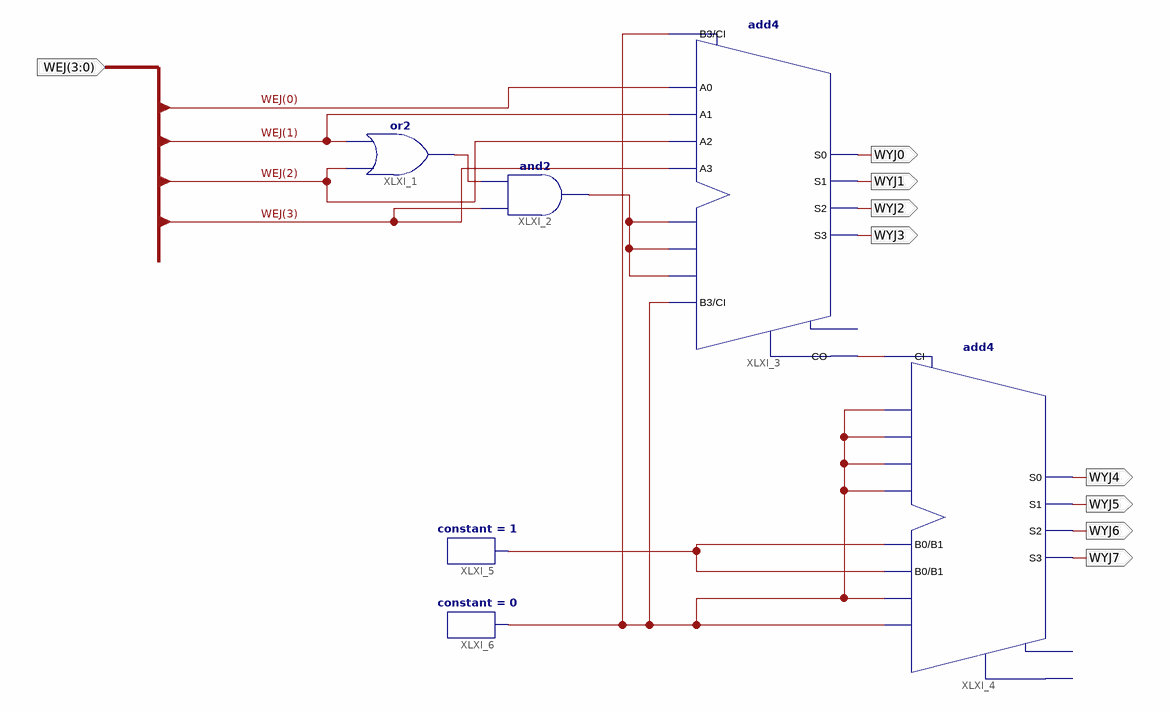
[diagram p0: schematic sheet 1]
// Xilinx ISE schematic scheme_diodes.sch (xc9500xl) as structural Verilog: 6 symbols, 9 ports
module scheme_diodes (
  input  [3:0] WEJ,
  output WYJ0,
  output WYJ1,
  output WYJ2,
  output WYJ3,
  output WYJ4,
  output WYJ5,
  output WYJ6,
  output WYJ7
);

  wire XLXN_8, XLXN_11, XLXN_22, XLXN_27, XLXN_30;

  or XLXI_1 (XLXN_22, WEJ[2], WEJ[1]);
  and XLXI_2 (XLXN_27, WEJ[3], XLXN_22);
  add4 XLXI_3 (
    .A0(WEJ[0]), .A1(WEJ[1]), .A2(WEJ[2]), .A3(WEJ[3]), .B0(XLXN_27), .B1(XLXN_27), .B2(XLXN_27),
    .B3(XLXN_30), .CI(XLXN_30), .CO(XLXN_11), .S0(WYJ0), .S1(WYJ1), .S2(WYJ2), .S3(WYJ3));  // open: OFL
  add4 XLXI_4 (
    .A0(XLXN_30), .A1(XLXN_30), .A2(XLXN_30), .A3(XLXN_30), .B0(XLXN_8), .B1(XLXN_8), .B2(XLXN_30),
    .B3(XLXN_30), .CI(XLXN_11), .S0(WYJ4), .S1(WYJ5), .S2(WYJ6), .S3(WYJ7));  // open: CO, OFL
  constant #(.CValue("1")) XLXI_5 (.O(XLXN_8));
  constant #(.CValue("0")) XLXI_6 (.O(XLXN_30));
endmodule
